# Altium schematic sheet Main.SchDoc
size A4; SheetNumber: 1; SheetTotal: 3
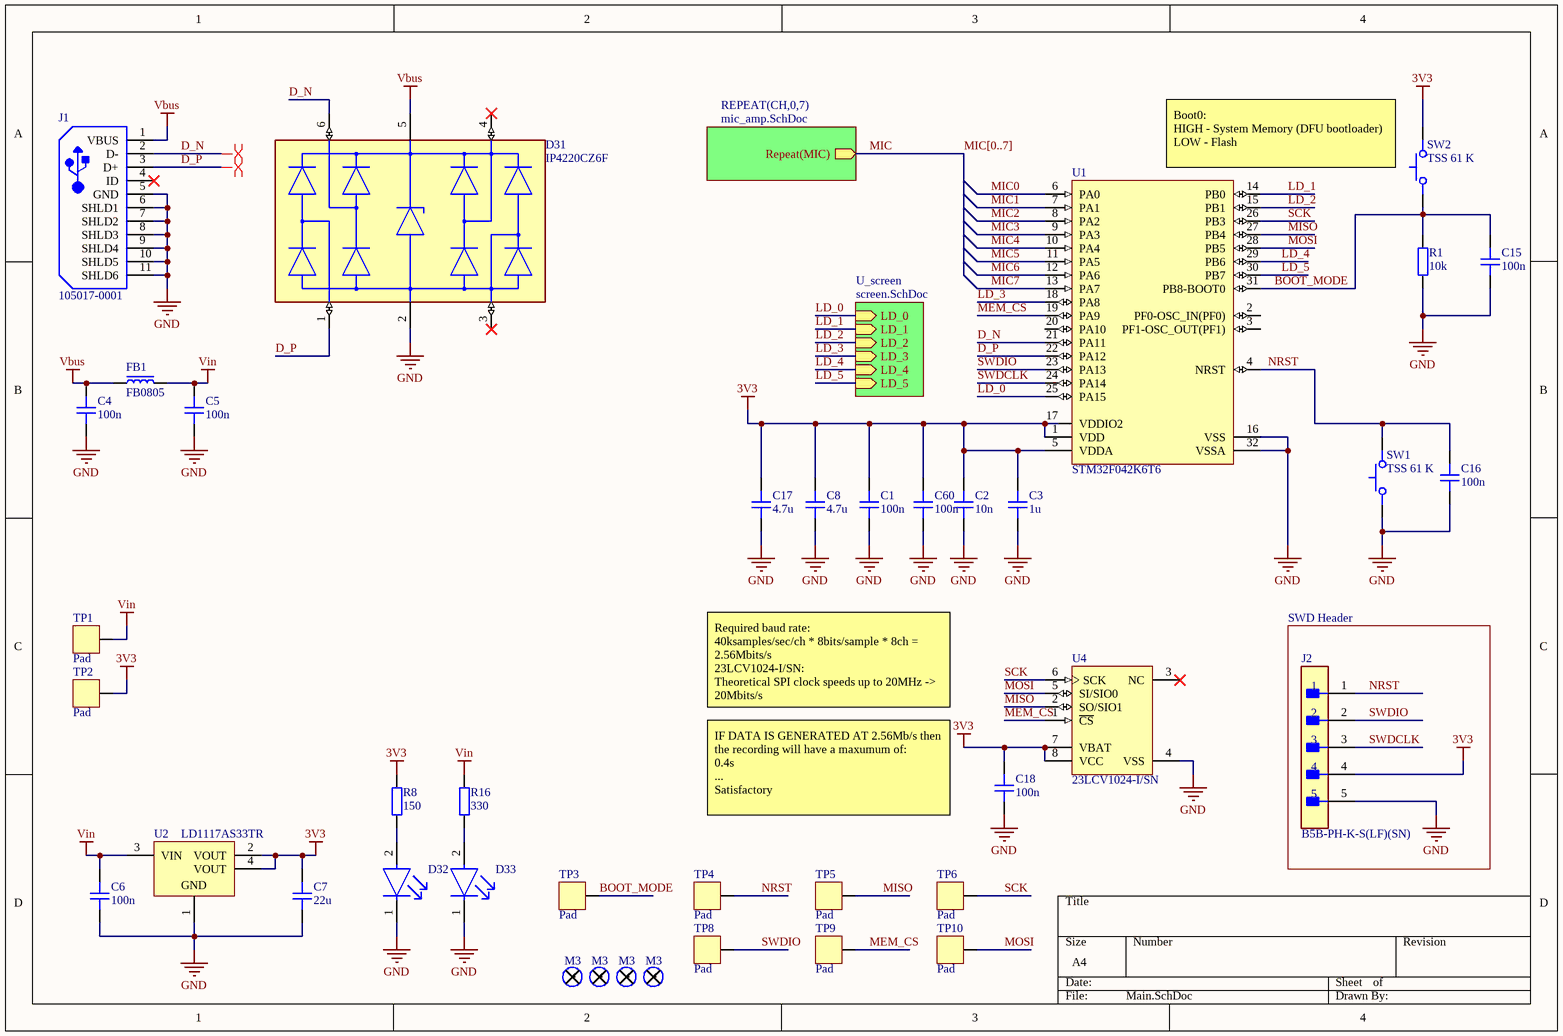
[diagram p0: Main.SchDoc]

## Parts
*  M3Hole  [M3_Hole]  (value not drawn)  (no BOM)
*1  M3Hole  [M3_Hole]  (value not drawn)  (no BOM)
*2  M3Hole  [M3_Hole]  (value not drawn)  (no BOM)
*3  M3Hole  [M3_Hole]  (value not drawn)  (no BOM)
C1  100n  [CAP_0603]
C2  10n  [CAP_0603]
C3  1u  [CAP_0603]
C4  100n  [CAP_0603]
C5  100n  [CAP_0603]
C6  100n  [CAP_0603]
C7  22u  [CAP_0603]
C8  4.7u  [CAP_0603]
C15  100n  [CAP_0603]
C16  100n  [CAP_0603]
C17  4.7u  [CAP_0603]
C18  100n  [CAP_0603]
C60  100n  [CAP_0603]
D31  IP4220CZ6F  [FP-SOT457-IPC_A]
D32  598-8270-107F  [FP-598-8270-107F-MFG]  (value not drawn)
D33  598-8270-107F  [FP-598-8270-107F-MFG]  (value not drawn)
FB1  FB0805  [FB_0805]
J1  105017-0001  [USB-MICRO-B_V]
J2  B5B-PH-K-S(LF)(SN)  [FP-B5B-PH-K-S_LF_SN-MFG]
R1  10k  [RES_0603]
R8  150  [RES_0603]
R16  330  [RES_0603]
SW1  TSS 61 K  [Generic SMD Tactile switch]
SW2  TSS 61 K  [Generic SMD Tactile switch]
TP1  Pad  [PAD_SQ_2MM]  (no BOM)
TP2  Pad  [PAD_SQ_2MM]  (no BOM)
TP3  Pad  [PAD_SQ_2MM]  (no BOM)
TP4  Pad  [PAD_SQ_2MM]  (no BOM)
TP5  Pad  [PAD_SQ_2MM]  (no BOM)
TP6  Pad  [PAD_SQ_2MM]  (no BOM)
TP8  Pad  [PAD_SQ_2MM]  (no BOM)
TP9  Pad  [PAD_SQ_2MM]  (no BOM)
TP10  Pad  [PAD_SQ_2MM]  (no BOM)
U1  STM32F042K6T6  [STM-LQFP32_M]
U2  LD1117AS33TR  [SOT-223_M]
U4  23LCV1024-I/SN  [MCHP-SOIC-SN8_L]

## Blocks framed on the sheet
SWD Header: J2

## Sub-sheets
REPEAT(CH,0,7) = mic_amp.SchDoc: Repeat(MIC) (out)
U_screen = screen.SchDoc: LD_5 (in), LD_4 (in), LD_3 (in), LD_2 (in), LD_1 (in), LD_0 (in)

## Nets
3V3: C1.2 C2.2 C3.2 C7.2 C8.2 C17.2 C18.2 C60.2 J2.4 R8.2 SW2.2 TP2.1 U1.1(VDD) U1.5(VDDA) U1.17(VDDIO2) U2.2(VOUT) U2.4(VOUT) U4.7(VBAT) U4.8(VCC)
GND: C1.1 C2.1 C3.1 C4.1 C5.1 C6.1 C7.1 C8.1 C15.1 C16.1 C17.1 C18.1 C60.1 D31.2(GND) D32.1(C) D33.1(C) J1.5(GND) J1.6(SHLD1) J1.7(SHLD2) J1.8(SHLD3) J1.9(SHLD4) J1.10(SHLD5) J1.11(SHLD6) J2.5 R1.1 SW1.1 U1.16(VSS) U1.32(VSSA) U2.1(GND) U4.4(VSS)
Vbus: C4.2 D31.5(VP) FB1.1 J1.1(VBUS)
Vin: C5.2 C6.2 FB1.2 R16.2 TP1.1 U2.3(VIN)
BOOT_MODE: C15.2 R1.2 SW2.1 TP3.1 U1.31(PB8-BOOT0)
D_N: D31.6(I/O4) J1.2(D-) U1.21(PA11)
D_P: D31.1(I/O1) J1.3(D+) U1.22(PA12)
LD_0: U1.25(PA15) ; sheet U_screen/LD_0
LD_1: U1.14(PB0) ; sheet U_screen/LD_1
LD_2: U1.15(PB1) ; sheet U_screen/LD_2
LD_3: U1.18(PA8) ; sheet U_screen/LD_3
LD_4: U1.29(PB6) ; sheet U_screen/LD_4
LD_5: U1.30(PB7) ; sheet U_screen/LD_5
MEM_CS: TP9.1 U1.19(PA9) U4.1(~{CS})
MIC: sheet REPEAT(CH,0,7)/Repeat(MIC)
MIC0: U1.6(PA0)
MIC1: U1.7(PA1)
MIC2: U1.8(PA2)
MIC3: U1.9(PA3)
MIC4: U1.10(PA4)
MIC5: U1.11(PA5)
MIC6: U1.12(PA6)
MIC7: U1.13(PA7)
MISO: TP5.1 U1.27(PB4) U4.2(SO/SIO1)
MOSI: TP10.1 U1.28(PB5) U4.5(SI/SIO0)
NRST: C16.2 J2.1 SW1.2 TP4.1 U1.4(NRST)
SCK: TP6.1 U1.26(PB3) U4.6(SCK)
SWDCLK: J2.3 U1.24(PA14)
SWDIO: J2.2 TP8.1 U1.23(PA13)
NetD32_2: D32.2(A) R8.1
NetD33_2: D33.2(A) R16.1

Not connected (* = marked no-connect by the designer): * 0; *1 0; *2 0; *3 0; D31 3(I/O2)* 4(I/O3)*; J1 4(ID)*; U1 2(PF0-OSC_IN(PF0)) 3(PF1-OSC_OUT(PF1)) 20(PA10); U4 3(NC)*

## Buses and harness runs
bus MIC[0..7]

## Layout directives
differential pair; rule Impedance Constraint [Min = 80.00    Max = 100.0    ]; rule Length Constraint [Min Length = 0mil    Max Length = 3937.008mil]: D_N
differential pair: D_P

## Notes on the sheet
- Boot0:
  HIGH - System Memory (DFU bootloader)
  LOW - Flash
- Required baud rate:
  40ksamples/sec/ch * 8bits/sample * 8ch = 2.56Mbits/s
  23LCV1024-I/SN:
  Theoretical SPI clock speeds up to 20MHz -> 20Mbits/s
- IF DATA IS GENERATED AT 2.56Mb/s then the recording will have a maxumum of:
  0.4s
  ...
  Satisfactory
- (in symbol M3Hole) M3

## Library data of the parts
C1-C8 C15-C18 C60 = CAP_0603: Capacitor SMD 0603, X7R, 10V; Manufacturer: *; Manufacturer Part Number: *; Distributor Link: *; LCSC: *; Rating: *; Dielectric: *
D31 = CMP-14432-000004-1: TVS DIODE 5.5VWM 6TSOP; RoHS Compliant: Yes
D32 D33 = CMP-15384-000006-1: SM LED 1206 ALINGAP G 7 REEL; Reverse Voltage: 5V; Viewing Angle: 140°; Power Dissipation: 60mW; Number of Elements: 1; Luminous Intensity: 20mcd; Color: Green; Lens Size: 1.6mm; Dominant Wavelength: 570nm; Test Current: 20mA; Forward Voltage: 2V; Lens Color: Colorless; Lens Transparency: Clear; Lens Style: Flat; Case/Package: 1206; RoHS Compliant: Yes; Number of Pins: 2; Packaging: Tape and Reel; Case Code (Metric): 3216; Lead Free: Lead Free; REACH SVHC: No SVHC; Height: 0.7mm; Depth: 1.6mm; Radiation Hardening: No; Length: 3.2mm; Wavelength: 570nm; Illumination Color: Green; Max Operating Temperature: 85°C; Min Operating Temperature: -30°C; Case Code (Imperial): 1206; Series: 598; Package Quantity: 3000; Mount: Surface Mount; Number of LEDs: 1; Forward Current: 20mA; Width: 1.6mm
FB1 = FB_0805: Ferrite Bead SMD 0805; Manufacturer: *; Manufacturer Part Number: *; Distributor Link: *; LCSC: *
J1 = CMP-2000-05827-1: Micro-USB B Receptacle, Right Angle, Bottom Mount, Surface Mount, with Solder Tabs, -30 to 85 degC, 5-Pin USB, RoHS, Tape and Reel; Manufacturer: Molex; Featured Product: Micro-USBConnectorsUSBConnectors; Other Names: WM1399DKR; Package Version: Rev. F, 12/2012; Number of Contacts: 5; Connector Type: USB-microB; Catalog Drawings: 1050170001; 3D Model: 105017-0001.stp; Mating Products: WM17145-ND-CABLEMICROUSBBTOSTDA1.0MWM17147-ND-CABLEMICROUSBBTOSTDA2.0MWM17146-ND-CABLEMICROUSBBTOSTDA1.5M; PCN Assembly/Origin: ResinSupplier21/Oct/2015; Voltage - Max: 30V; Online Catalog: Molex-MicroUSB; Manufacturer URL: http://www.molex.com/; Package Description: 5-Leads USB, Micro B, Body 7.5 x 5 mm, Pitch 0.65 mm; Datasheet URL: http://www.molex.com/elqNow/elqRedir.htm?ref=http://www.molex.com/webdocs/datasheets/pdf/en-us/1050170001_IO_CONNECTORS.pdf; Ingress Protection: -; Datasheet Version: 03/2016; Mounting Type: BoardCutout,SurfaceMount,RightAngle; Circuits: 5; Standard Package: 1; Package Reference: MICRO-B; Package URL: http://www.molex.com/pdm_docs/sd/1050170001_sd.pdf; Category: Connectors,Interconnects; Series: -; RoHS Information: 1050170001CertofCompliance; Features: Shielded,SolderRetention; Family: USB,DVI,HDMIConnectors; Specifications: -; Gender: Receptacle; Packaging: Digi-Reel®; Mounting Technology: SurfaceMount
J2 = CMP-2000-05908-2: CONN HEADER VERT 5POS 2MM; Voltage Rating (AC): 100V; Number of Positions: 5; Contact Resistance: 20mR; Insulation Resistance: 1MR; Current Rating: 2A; Gender: Male; Mated Stacking Heights: 8mm; Series: PH; Number of Poles: 5; Width: 4.5mm; Insulation Color: Natural; Fastening Type: Detent; Flammability Rating: UL94 V-0; Mount: Through Hole; Lead Free: Lead Free; Number of Rows: 1; REACH SVHC: No SVHC; Max Voltage Rating (AC): 100V; Contact Mating Length: 0.13inch; Contact Plating: Tin; Housing Material: Polyamide; Depth: 4.5mm; Contact Type: Male Pin; Voltage Rating: 100V; Color: Natural; Housing Color: White; Lead Pitch: 2mm; Number of Contacts: 5; Orientation: Straight; Packaging: Bulk; Contact Material: Brass; Pitch: 2mm; Insulation Material: Nylon; Connector Type: Header; Contact Finish - Mating: TIN; Termination: Solder; Number of Pins: 5; Length: 11.9mm; Contact Shape: Square; Max Current Rating: 2A; Working Voltage: 100V; Min Operating Temperature: -25°C; Max Operating Temperature: 85°C; Material: Polyamide; Height: 9.4mm
R1 R8 R16 = RES_0603: Resistor SMD 0603; Manufacturer: *; Manufacturer Part Number: *; Distributor Link: *; LCSC: *
SW1 SW2 = TSS 61 K: Keypad Switch, 1 Switches, SPST, Momentary, 0.05A, 12VDC, 1.47N, Solder Terminal, Surface Mount-straight; pin to pad: 1>1+2 2>3+4; Manufacturer: Knitter-Switch; Manufacturer Part Number: TSS61K; End Contact Plating: Silver; End Contact Material: Bronze; Actuator Type: STEM; Circuit Configuration: 1X1; Contact Current(DC)-Max: 50mA; Contact DC Max Rating R Load: .05A@12VDC; Contact Resistance: 0.1mR; Contact Voltage(DC)-Max: 12V; Dielectric Withstand Volts: 250VACV; Electrical Life: 200000Cycles; Insulation Resistance: 100MR; Number of Switches: 1; Solderability: REFLOW; Actuator Length: 0.031inch; Body Breadth: 6.2inch; Body Height: 3.5mm; Body Length or Diameter: 6.2mm; Supplier: TME; Supplier Part Number: TSS61K; RoHS: Yes; Category: Tactile Switches; Stock: 975; Mounting Technology: Surface Mount; Contact Material: Bronze; Center Contact Plating: Silver; Housing Material: Stainless Steel; Terminal Finish: Silver; Terminal Material: Brass; Min Operating Temperature: -40°C; Max Operating Temperature: 85°C; JESD-609 Code: e4; Operating Force-Max: 1.47N; Switch Action: MOMENTARY; Switch Function: SPST; Switch Type: Keypad; Termination: Solder; Reach SVHC Compliant: Yes; RoHS Compliant: Yes; ComponentLink1URL: https://datasheet.ciiva.com:443/pdfs/VipMasterIC/IC/KNSW/KNSW-S-A0003711307/KNSW-S-A0003711307-1.pdf?src-supplier=IHS+Markit; ComponentLink1Description: https://datasheet.ciiva.com:443/pdfs/VipMasterIC/IC/KNSW/KNSW-S-A0003711307/KNSW-S-A0003711307-1.pdf?src-supplier=IHS+Markit; ComponentLink2URL: http://www.knitter-switch.com/pdf_en/3_6_3%20TSS%20TS%20TMSE.pdf?src-supplier=Avnet; ComponentLink2Description: http://www.knitter-switch.com/pdf_en/3_6_3%20TSS%20TS%20TMSE.pdf?src-supplier=Avnet
TP1-TP6 TP8-TP10 = PAD_SQ_2MM: Test Point Square 2mm
U1 = CMP-0304-00114-2: ARM Cortex-M0 32-bit MCU, 32 KB Flash, 6 KB Internal RAM, 28 I/Os, 32-Pin LQFP, -40 to 85 degC, Tray; Manufacturer: STMicroelectronics; Operating Frequency(F) (Processor speed) (MHz): 48; Internal RAM Size (kB): 6; Supply Voltage(Vcc) min (V): 2; I/Os (High Current): 28; FLASH Size (Prog) (kB): 32; ComponentLink1Description: Manufacturer URL; Package Reference: LQFP32; ComponentLink2Description: Datasheet; ComponentLink1URL: http://www.st.com/; Core: ARM Cortex-M0; DatasheetVersion: Rev. 5; ComponentLink2URL: http://www.st.com/st-web-ui/static/active/en/resource/technical/document/datasheet/DM00105814.pdf; Packing: Tray; Package Description: 32-Pin Low Profile Quad Flat Package, 7 x 7 mm Body, 0.8 mm Pitch; PartNumber: STM32F042K6T6; Mounting Technology: Surface Mount
U2 = CMP-0244-00316-1: 1A, Low Drop Positive Voltage Regulator, 3.3V, 4-Pin SOT-223, Tape and Reel; ComponentLink1Description: Manufacturer URL; DatasheetVersion: 2/12/2011; PackageVersion: 2010; ComponentLink1URL: http://www.st.com; ComponentLink2Description: Datasheet; ComponentLink2URL: http://www.st.com/internet/com/TECHNICAL_RESOURCES/TECHNICAL_LITERATURE/DATASHEET/CD00002116.pdf; PackageDescription: 4-Pin SOT-223 Package, 6.5 x 3.5 mm Body, 2.3 mm Pitch, 7 mm Lead Span; PackageReference: SOT-223
U4 = CMP-0163-00037-1: 1024K bits SPI Serial SRAM with Battery Backup and SDI Interface, 2.5 to 5.5 V, 20 MHz, -40 to 85 degC, 8-pin SOIC (SN8), Tube; Manufacturer: Microchip; DatasheetVersion: Rev. A; ComponentLink3Description: Package Specification; PackageReference: SOIC-SN8; Mounting Technology: Surface Mount; PartNumber: 23LCV1024-I/SN; ComponentLink4Description: Product URL; ComponentLink2Description: Datasheet; ComponentLink3URL: http://www.microchip.com/stellent/groups/techpub_sg/documents/packagingspec/en012702.pdf; PackageDescription: 8-Lead Plastic Small Outline, 4.9 x 3.9 mm Body, 1.27 mm Pitch; ComponentLink1Description: Manufacturer URL; ComponentLink2URL: http://ww1.microchip.com/downloads/en/DeviceDoc/25156A.pdf; ComponentLink4URL: http://www.microchip.com/23LCV1024; ComponentLink1URL: http://www.microchip.com; PackageVersion: C04-057C